# Altium schematic sheet Sheet1.SchDoc
size A3; DocumentNumber: 1; SheetNumber: 1; SheetTotal: 7
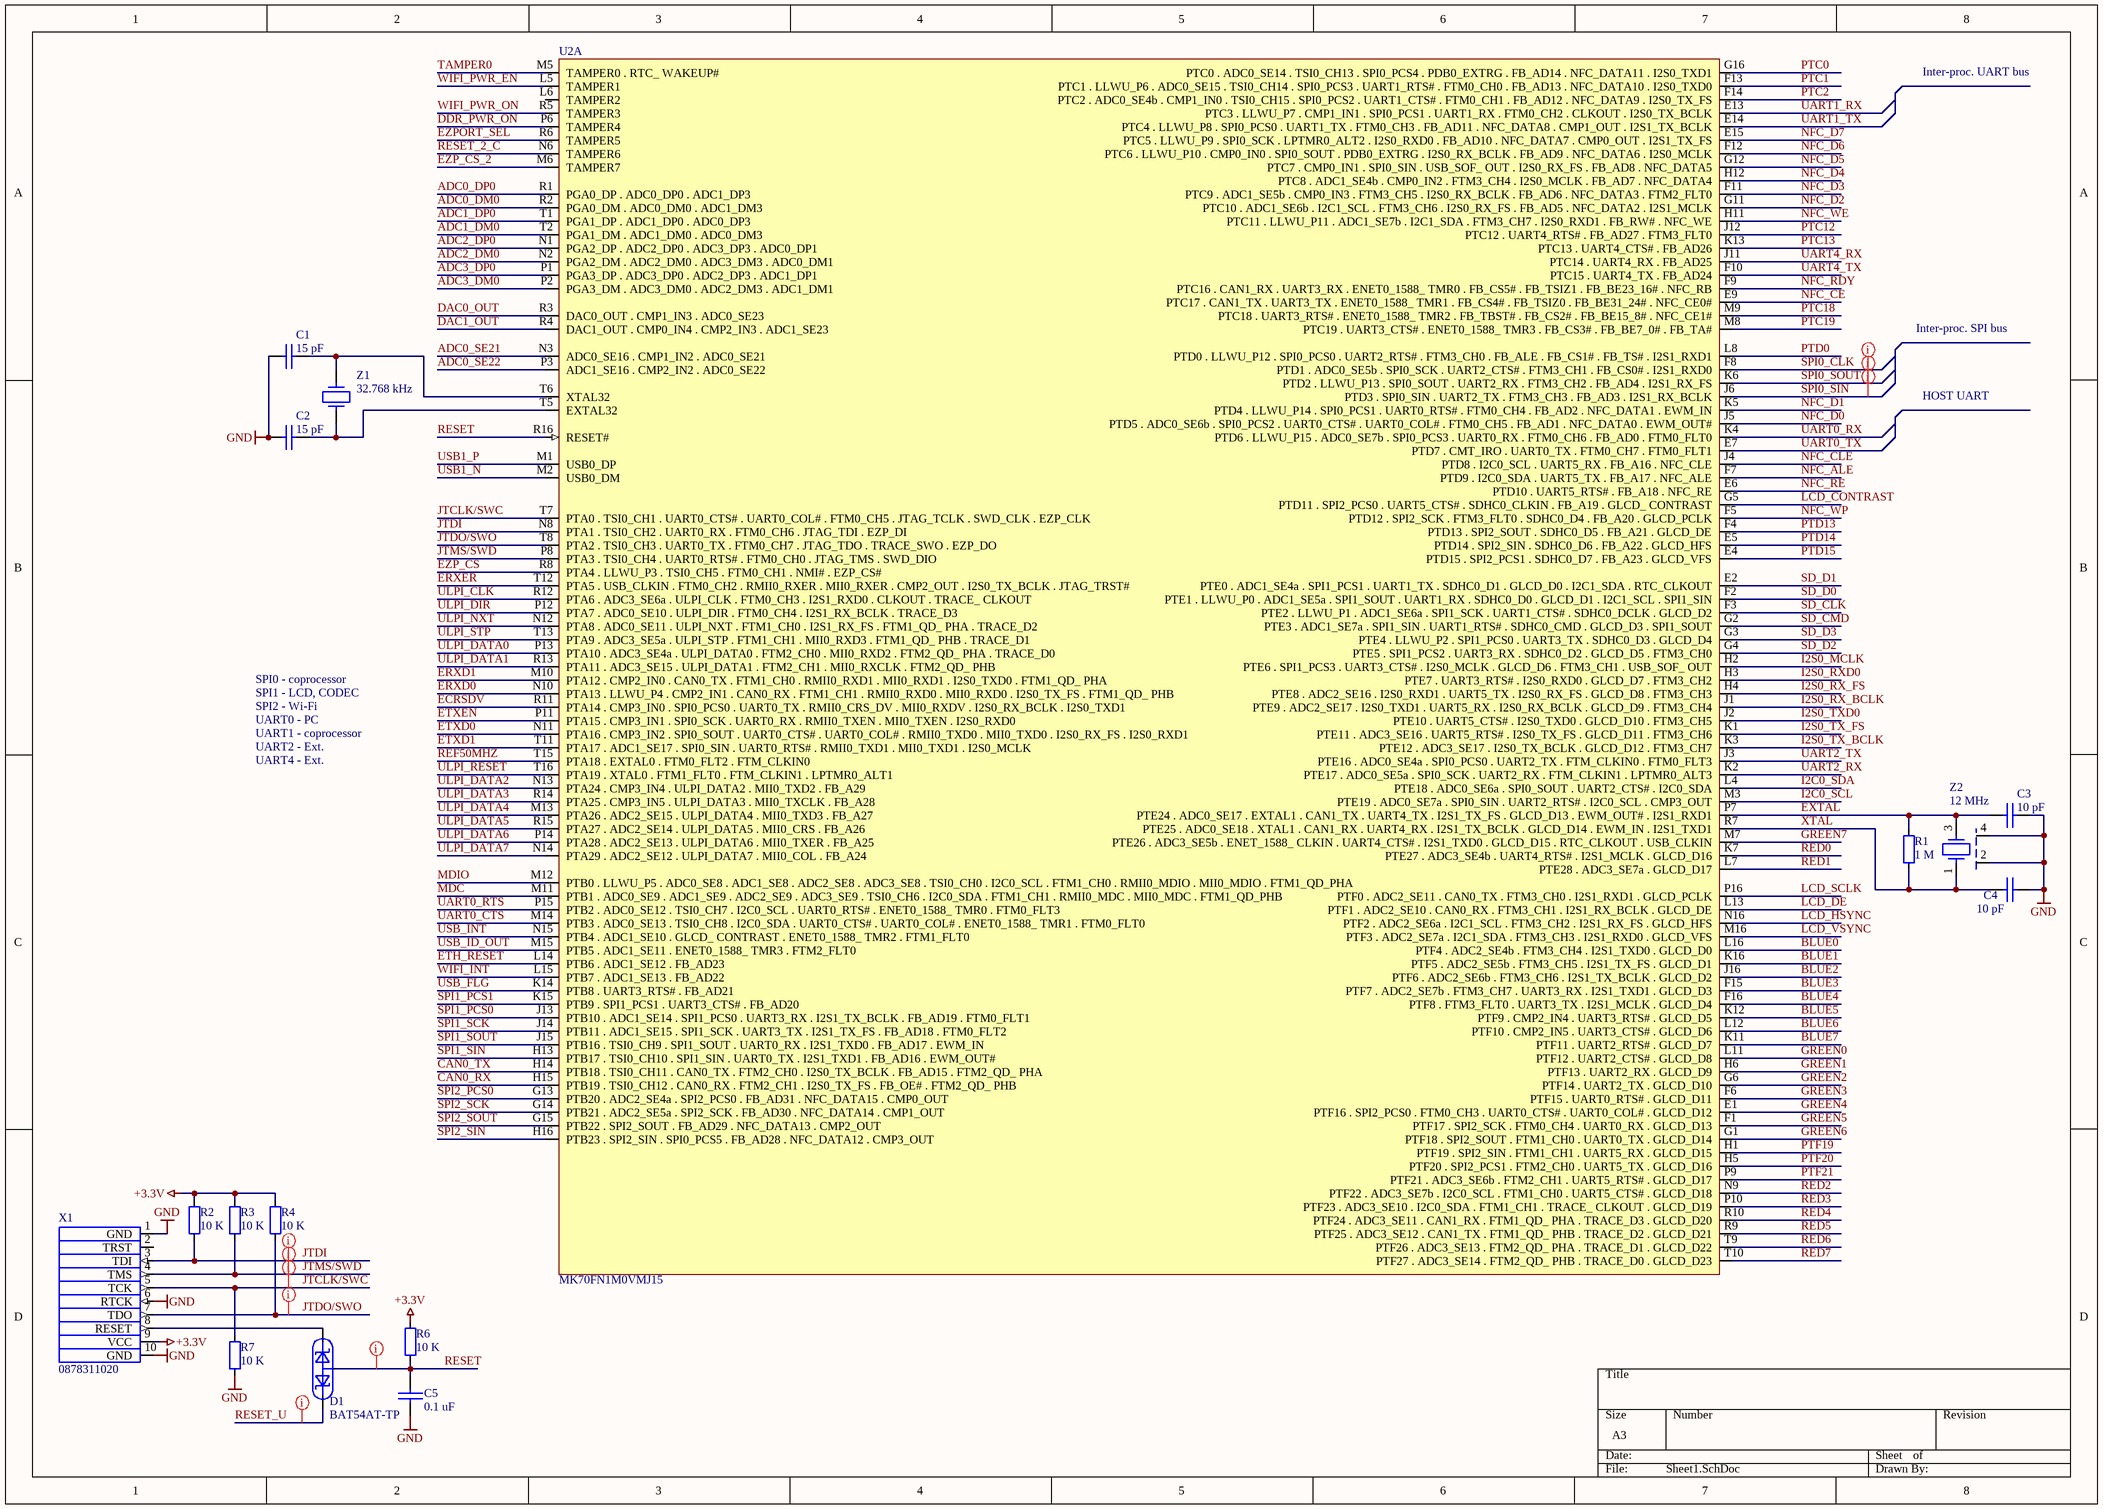
[diagram p0: Sheet1.SchDoc]

## Parts
C1  value 15 pF  [1608[0603]]  (hidden comment: CC0603JRNPO9BN150)
C2  value 15 pF  [1608[0603]]  (hidden comment: CC0603JRNPO9BN150)
C3  value 10 pF  [1608[0603]]  (hidden comment: CCPF010K0603)
C4  value 10 pF  [1608[0603]]  (hidden comment: CCPF010K0603)
C5  value 0.1 uF  [1005[0402]]  (hidden comment: CL10B104KA8NNND)
D1  BAT54AT-TP  [SOT-523F]
R1  value 1 M  [0603]  (hidden comment: RC0603FR-071ML)
R2  value 10 K  [0402]  (hidden comment: ERJ-3EKF1002V)
R3  value 10 K  [0402]  (hidden comment: ERJ-3EKF1002V)
R4  value 10 K  [0402]  (hidden comment: ERJ-3EKF1002V)
R6  value 10 K  [0402]  (hidden comment: ERJ-3EKF1002V)
R7  value 10 K  [0402]  (hidden comment: ERJ-3EKF1002V)
U2  MK70FN1M0VMJ15  [MAPBGA 256-pin]  (part A of 2)
X1  0878311020  [878311020 MGRID WALL HDR SMD]
Z1  value 32.768 kHz  [ABS10]  (hidden comment: CM200C32768DZBT)
Z2  value 12 MHz  [DSX321G]  (hidden comment: NX3225SA-12.000MHZ-STD-CSR-1)

## Nets
+3.3V: R2.1 R3.1 R4.1 R6.1 X1.9(VCC)
GND: C1.2 C2.2 C3.2 C4.2 C5.2 R7.2 X1.1(GND) X1.6(RTCK) X1.10(GND) Z2.2 Z2.4
ADC0_DM0: U2.R2(PGA0_DM_._ADC0_DM0_._ADC1_DM3)
ADC0_DP0: U2.R1(PGA0_DP_._ADC0_DP0_._ADC1_DP3)
ADC0_SE21: U2.N3(ADC0_SE16_._CMP1_IN2_._ADC0_SE21)
ADC0_SE22: U2.P3(ADC1_SE16_._CMP2_IN2_._ADC0_SE22)
ADC1_DM0: U2.T2(PGA1_DM_._ADC1_DM0_._ADC0_DM3)
ADC1_DP0: U2.T1(PGA1_DP_._ADC1_DP0_._ADC0_DP3)
ADC2_DM0: U2.N2(PGA2_DM_._ADC2_DM0_._ADC3_DM3_._ADC0_DM1)
ADC2_DP0: U2.N1(PGA2_DP_._ADC2_DP0_._ADC3_DP3_._ADC0_DP1)
ADC3_DM0: U2.P2(PGA3_DM_._ADC3_DM0_._ADC2_DM3_._ADC1_DM1)
ADC3_DP0: U2.P1(PGA3_DP_._ADC3_DP0_._ADC2_DP3_._ADC1_DP1)
BLUE0: U2.L16(PTF4_._ADC2_SE4b_._FTM3_CH4_._I2S1_TXD0_._GLCD_D0)
BLUE1: U2.K16(PTF5_._ADC2_SE5b_._FTM3_CH5_._I2S1_TX_FS_._GLCD_D1)
BLUE2: U2.J16(PTF6_._ADC2_SE6b_._FTM3_CH6_._I2S1_TX_BCLK_._GLCD_D2)
BLUE3: U2.F15(PTF7_._ADC2_SE7b_._FTM3_CH7_._UART3_RX_._I2S1_TXD1_._GLCD_D3)
BLUE4: U2.F16(PTF8_._FTM3_FLT0_._UART3_TX_._I2S1_MCLK_._GLCD_D4)
BLUE5: U2.K12(PTF9_._CMP2_IN4_._UART3_RTS#_._GLCD_D5)
BLUE6: U2.L12(PTF10_._CMP2_IN5_._UART3_CTS#_._GLCD_D6)
BLUE7: U2.K11(PTF11_._UART2_RTS#_._GLCD_D7)
CAN0_RX: U2.H15(PTB19_._TSI0_CH12_._CAN0_RX_._FTM2_CH1_._I2S0_TX_FS_._FB_OE#_._FTM2_QD__PHB)
CAN0_TX: U2.H14(PTB18_._TSI0_CH11_._CAN0_TX_._FTM2_CH0_._I2S0_TX_BCLK_._FB_AD15_._FTM2_QD__PHA)
DAC0_OUT: U2.R3(DAC0_OUT_._CMP1_IN3_._ADC0_SE23)
DAC1_OUT: U2.R4(DAC1_OUT_._CMP0_IN4_._CMP2_IN3_._ADC1_SE23)
DDR_PWR_ON: U2.P6(TAMPER4)
ECRSDV: U2.R11(PTA14_._CMP3_IN0_._SPI0_PCS0_._UART0_TX_._RMII0_CRS_DV_._MII0_RXDV_._I2S0_RX_BCLK_._I2S0_TXD1)
ERXD0: U2.N10(PTA13_._LLWU_P4_._CMP2_IN1_._CAN0_RX_._FTM1_CH1_._RMII0_RXD0_._MII0_RXD0_._I2S0_TX_FS_._FTM1_QD__PHB)
ERXD1: U2.M10(PTA12_._CMP2_IN0_._CAN0_TX_._FTM1_CH0_._RMII0_RXD1_._MII0_RXD1_._I2S0_TXD0_._FTM1_QD__PHA)
ERXER: U2.T12(PTA5_._USB_CLKIN_._FTM0_CH2_._RMII0_RXER_._MII0_RXER_._CMP2_OUT_._I2S0_TX_BCLK_._JTAG_TRST#)
ETH_RESET: U2.L14(PTB6_._ADC1_SE12_._FB_AD23)
ETXD0: U2.N11(PTA16_._CMP3_IN2_._SPI0_SOUT_._UART0_CTS#_._UART0_COL#_._RMII0_TXD0_._MII0_TXD0_._I2S0_RX_FS_._I2S0_RXD1)
ETXD1: U2.T11(PTA17_._ADC1_SE17_._SPI0_SIN_._UART0_RTS#_._RMII0_TXD1_._MII0_TXD1_._I2S0_MCLK)
ETXEN: U2.P11(PTA15_._CMP3_IN1_._SPI0_SCK_._UART0_RX_._RMII0_TXEN_._MII0_TXEN_._I2S0_RXD0)
EXTAL: C3.1 R1.2 U2.P7(PTE24_._ADC0_SE17_._EXTAL1_._CAN1_TX_._UART4_TX_._I2S1_TX_FS_._GLCD_D13_._EWM_OUT#_._I2S1_RXD1) Z2.3
EZP_CS: U2.R8(PTA4_._LLWU_P3_._TSI0_CH5_._FTM0_CH1_._NMI#_._EZP_CS#)
EZP_CS_2: U2.M6(TAMPER7)
EZPORT_SEL: U2.R6(TAMPER5)
GREEN0: U2.L11(PTF12_._UART2_CTS#_._GLCD_D8)
GREEN1: U2.H6(PTF13_._UART2_RX_._GLCD_D9)
GREEN2: U2.G6(PTF14_._UART2_TX_._GLCD_D10)
GREEN3: U2.F6(PTF15_._UART0_RTS#_._GLCD_D11)
GREEN4: U2.E1(PTF16_._SPI2_PCS0_._FTM0_CH3_._UART0_CTS#_._UART0_COL#_._GLCD_D12)
GREEN5: U2.F1(PTF17_._SPI2_SCK_._FTM0_CH4_._UART0_RX_._GLCD_D13)
GREEN6: U2.G1(PTF18_._SPI2_SOUT_._FTM1_CH0_._UART0_TX_._GLCD_D14)
GREEN7: U2.M7(PTE26_._ADC3_SE5b_._ENET_1588__CLKIN_._UART4_CTS#_._I2S1_TXD0_._GLCD_D15_._RTC_CLKOUT_._USB_CLKIN)
I2C0_SCL: U2.M3(PTE19_._ADC0_SE7a_._SPI0_SIN_._UART2_RTS#_._I2C0_SCL_._CMP3_OUT)
I2C0_SDA: U2.L4(PTE18_._ADC0_SE6a_._SPI0_SOUT_._UART2_CTS#_._I2C0_SDA)
I2S0_MCLK: U2.H2(PTE6_._SPI1_PCS3_._UART3_CTS#_._I2S0_MCLK_._GLCD_D6_._FTM3_CH1_._USB_SOF__OUT)
I2S0_RX_BCLK: U2.J1(PTE9_._ADC2_SE17_._I2S0_TXD1_._UART5_RX_._I2S0_RX_BCLK_._GLCD_D9_._FTM3_CH4)
I2S0_RX_FS: U2.H4(PTE8_._ADC2_SE16_._I2S0_RXD1_._UART5_TX_._I2S0_RX_FS_._GLCD_D8_._FTM3_CH3)
I2S0_RXD0: U2.H3(PTE7_._UART3_RTS#_._I2S0_RXD0_._GLCD_D7_._FTM3_CH2)
I2S0_TX_BCLK: U2.K3(PTE12_._ADC3_SE17_._I2S0_TX_BCLK_._GLCD_D12_._FTM3_CH7)
I2S0_TX_FS: U2.K1(PTE11_._ADC3_SE16_._UART5_RTS#_._I2S0_TX_FS_._GLCD_D11_._FTM3_CH6)
I2S0_TXD0: U2.J2(PTE10_._UART5_CTS#_._I2S0_TXD0_._GLCD_D10_._FTM3_CH5)
JTCLK/SWC: R7.1 U2.T7(PTA0_._TSI0_CH1_._UART0_CTS#_._UART0_COL#_._FTM0_CH5_._JTAG_TCLK_._SWD_CLK_._EZP_CLK) X1.5(TCK)
JTDI: R2.2 U2.N8(PTA1_._TSI0_CH2_._UART0_RX_._FTM0_CH6_._JTAG_TDI_._EZP_DI) X1.3(TDI)
JTDO/SWO: R4.2 U2.T8(PTA2_._TSI0_CH3_._UART0_TX_._FTM0_CH7_._JTAG_TDO_._TRACE_SWO_._EZP_DO) X1.7(TDO)
JTMS/SWD: R3.2 U2.P8(PTA3_._TSI0_CH4_._UART0_RTS#_._FTM0_CH0_._JTAG_TMS_._SWD_DIO) X1.4(TMS)
LCD_CONTRAST: U2.G5(PTD11_._SPI2_PCS0_._UART5_CTS#_._SDHC0_CLKIN_._FB_A19_._GLCD__CONTRAST)
LCD_DE: U2.L13(PTF1_._ADC2_SE10_._CAN0_RX_._FTM3_CH1_._I2S1_RX_BCLK_._GLCD_DE)
LCD_HSYNC: U2.N16(PTF2_._ADC2_SE6a_._I2C1_SCL_._FTM3_CH2_._I2S1_RX_FS_._GLCD_HFS)
LCD_SCLK: U2.P16(PTF0_._ADC2_SE11_._CAN0_TX_._FTM3_CH0_._I2S1_RXD1_._GLCD_PCLK)
LCD_VSYNC: U2.M16(PTF3_._ADC2_SE7a_._I2C1_SDA_._FTM3_CH3_._I2S1_RXD0_._GLCD_VFS)
MDC: U2.M11(PTB1_._ADC0_SE9_._ADC1_SE9_._ADC2_SE9_._ADC3_SE9_._TSI0_CH6_._I2C0_SDA_._FTM1_CH1_._RMII0_MDC_._MII0_MDC_._FTM1_QD_PHB)
MDIO: U2.M12(PTB0_._LLWU_P5_._ADC0_SE8_._ADC1_SE8_._ADC2_SE8_._ADC3_SE8_._TSI0_CH0_._I2C0_SCL_._FTM1_CH0_._RMII0_MDIO_._MII0_MDIO_._FTM1_QD_PHA)
NFC_ALE: U2.F7(PTD9_._I2C0_SDA_._UART5_TX_._FB_A17_._NFC_ALE)
NFC_CE: U2.E9(PTC17_._CAN1_TX_._UART3_TX_._ENET0_1588__TMR1_._FB_CS4#_._FB_TSIZ0_._FB_BE31_24#_._NFC_CE0#)
NFC_CLE: U2.J4(PTD8_._I2C0_SCL_._UART5_RX_._FB_A16_._NFC_CLE)
NFC_D0: U2.J5(PTD5_._ADC0_SE6b_._SPI0_PCS2_._UART0_CTS#_._UART0_COL#_._FTM0_CH5_._FB_AD1_._NFC_DATA0_._EWM_OUT#)
NFC_D1: U2.K5(PTD4_._LLWU_P14_._SPI0_PCS1_._UART0_RTS#_._FTM0_CH4_._FB_AD2_._NFC_DATA1_._EWM_IN)
NFC_D2: U2.G11(PTC10_._ADC1_SE6b_._I2C1_SCL_._FTM3_CH6_._I2S0_RX_FS_._FB_AD5_._NFC_DATA2_._I2S1_MCLK)
NFC_D3: U2.F11(PTC9_._ADC1_SE5b_._CMP0_IN3_._FTM3_CH5_._I2S0_RX_BCLK_._FB_AD6_._NFC_DATA3_._FTM2_FLT0)
NFC_D4: U2.H12(PTC8_._ADC1_SE4b_._CMP0_IN2_._FTM3_CH4_._I2S0_MCLK_._FB_AD7_._NFC_DATA4)
NFC_D5: U2.G12(PTC7_._CMP0_IN1_._SPI0_SIN_._USB_SOF__OUT_._I2S0_RX_FS_._FB_AD8_._NFC_DATA5)
NFC_D6: U2.F12(PTC6_._LLWU_P10_._CMP0_IN0_._SPI0_SOUT_._PDB0_EXTRG_._I2S0_RX_BCLK_._FB_AD9_._NFC_DATA6_._I2S0_MCLK)
NFC_D7: U2.E15(PTC5_._LLWU_P9_._SPI0_SCK_._LPTMR0_ALT2_._I2S0_RXD0_._FB_AD10_._NFC_DATA7_._CMP0_OUT_._I2S1_TX_FS)
NFC_RDY: U2.F9(PTC16_._CAN1_RX_._UART3_RX_._ENET0_1588__TMR0_._FB_CS5#_._FB_TSIZ1_._FB_BE23_16#_._NFC_RB)
NFC_RE: U2.E6(PTD10_._UART5_RTS#_._FB_A18_._NFC_RE)
NFC_WE: U2.H11(PTC11_._LLWU_P11_._ADC1_SE7b_._I2C1_SDA_._FTM3_CH7_._I2S0_RXD1_._FB_RW#_._NFC_WE)
NFC_WP: U2.F5(PTD12_._SPI2_SCK_._FTM3_FLT0_._SDHC0_D4_._FB_A20_._GLCD_PCLK)
PTC0: U2.G16(PTC0_._ADC0_SE14_._TSI0_CH13_._SPI0_PCS4_._PDB0_EXTRG_._FB_AD14_._NFC_DATA11_._I2S0_TXD1)
PTC1: U2.F13(PTC1_._LLWU_P6_._ADC0_SE15_._TSI0_CH14_._SPI0_PCS3_._UART1_RTS#_._FTM0_CH0_._FB_AD13_._NFC_DATA10_._I2S0_TXD0)
PTC2: U2.F14(PTC2_._ADC0_SE4b_._CMP1_IN0_._TSI0_CH15_._SPI0_PCS2_._UART1_CTS#_._FTM0_CH1_._FB_AD12_._NFC_DATA9_._I2S0_TX_FS)
PTC12: U2.J12(PTC12_._UART4_RTS#_._FB_AD27_._FTM3_FLT0)
PTC13: U2.K13(PTC13_._UART4_CTS#_._FB_AD26)
PTC18: U2.M9(PTC18_._UART3_RTS#_._ENET0_1588__TMR2_._FB_TBST#_._FB_CS2#_._FB_BE15_8#_._NFC_CE1#)
PTC19: U2.M8(PTC19_._UART3_CTS#_._ENET0_1588__TMR3_._FB_CS3#_._FB_BE7_0#_._FB_TA#)
PTD0: U2.L8(PTD0_._LLWU_P12_._SPI0_PCS0_._UART2_RTS#_._FTM3_CH0_._FB_ALE_._FB_CS1#_._FB_TS#_._I2S1_RXD1)
PTD13: U2.F4(PTD13_._SPI2_SOUT_._SDHC0_D5_._FB_A21_._GLCD_DE)
PTD14: U2.E5(PTD14_._SPI2_SIN_._SDHC0_D6_._FB_A22_._GLCD_HFS)
PTD15: U2.E4(PTD15_._SPI2_PCS1_._SDHC0_D7_._FB_A23_._GLCD_VFS)
PTF19: U2.H1(PTF19_._SPI2_SIN_._FTM1_CH1_._UART5_RX_._GLCD_D15)
PTF20: U2.H5(PTF20_._SPI2_PCS1_._FTM2_CH0_._UART5_TX_._GLCD_D16)
PTF21: U2.P9(PTF21_._ADC3_SE6b_._FTM2_CH1_._UART5_RTS#_._GLCD_D17)
RED0: U2.K7(PTE27_._ADC3_SE4b_._UART4_RTS#_._I2S1_MCLK_._GLCD_D16)
RED1: U2.L7(PTE28_._ADC3_SE7a_._GLCD_D17)
RED2: U2.N9(PTF22_._ADC3_SE7b_._I2C0_SCL_._FTM1_CH0_._UART5_CTS#_._GLCD_D18)
RED3: U2.P10(PTF23_._ADC3_SE10_._I2C0_SDA_._FTM1_CH1_._TRACE__CLKOUT_._GLCD_D19)
RED4: U2.R10(PTF24_._ADC3_SE11_._CAN1_RX_._FTM1_QD__PHA_._TRACE_D3_._GLCD_D20)
RED5: U2.R9(PTF25_._ADC3_SE12_._CAN1_TX_._FTM1_QD__PHB_._TRACE_D2_._GLCD_D21)
RED6: U2.T9(PTF26_._ADC3_SE13_._FTM2_QD__PHA_._TRACE_D1_._GLCD_D22)
RED7: U2.T10(PTF27_._ADC3_SE14_._FTM2_QD__PHB_._TRACE_D0_._GLCD_D23)
REF50MHZ: U2.T15(PTA18_._EXTAL0_._FTM0_FLT2_._FTM_CLKIN0)
RESET: C5.1 D1.3 R6.2 U2.R16(RESET#)
RESET_2_C: U2.N6(TAMPER6)
RESET_U: D1.2
SD_CLK: U2.F3(PTE2_._LLWU_P1_._ADC1_SE6a_._SPI1_SCK_._UART1_CTS#_._SDHC0_DCLK_._GLCD_D2)
SD_CMD: U2.G2(PTE3_._ADC1_SE7a_._SPI1_SIN_._UART1_RTS#_._SDHC0_CMD_._GLCD_D3_._SPI1_SOUT)
SD_D0: U2.F2(PTE1_._LLWU_P0_._ADC1_SE5a_._SPI1_SOUT_._UART1_RX_._SDHC0_D0_._GLCD_D1_._I2C1_SCL_._SPI1_SIN)
SD_D1: U2.E2(PTE0_._ADC1_SE4a_._SPI1_PCS1_._UART1_TX_._SDHC0_D1_._GLCD_D0_._I2C1_SDA_._RTC_CLKOUT)
SD_D2: U2.G4(PTE5_._SPI1_PCS2_._UART3_RX_._SDHC0_D2_._GLCD_D5_._FTM3_CH0)
SD_D3: U2.G3(PTE4_._LLWU_P2_._SPI1_PCS0_._UART3_TX_._SDHC0_D3_._GLCD_D4)
SPI0_CLK: U2.F8(PTD1_._ADC0_SE5b_._SPI0_SCK_._UART2_CTS#_._FTM3_CH1_._FB_CS0#_._I2S1_RXD0)
SPI0_SIN: U2.J6(PTD3_._SPI0_SIN_._UART2_TX_._FTM3_CH3_._FB_AD3_._I2S1_RX_BCLK)
SPI0_SOUT: U2.K6(PTD2_._LLWU_P13_._SPI0_SOUT_._UART2_RX_._FTM3_CH2_._FB_AD4_._I2S1_RX_FS)
SPI1_PCS0: U2.J13(PTB10_._ADC1_SE14_._SPI1_PCS0_._UART3_RX_._I2S1_TX_BCLK_._FB_AD19_._FTM0_FLT1)
SPI1_PCS1: U2.K15(PTB9_._SPI1_PCS1_._UART3_CTS#_._FB_AD20)
SPI1_SCK: U2.J14(PTB11_._ADC1_SE15_._SPI1_SCK_._UART3_TX_._I2S1_TX_FS_._FB_AD18_._FTM0_FLT2)
SPI1_SIN: U2.H13(PTB17_._TSI0_CH10_._SPI1_SIN_._UART0_TX_._I2S1_TXD1_._FB_AD16_._EWM_OUT#)
SPI1_SOUT: U2.J15(PTB16_._TSI0_CH9_._SPI1_SOUT_._UART0_RX_._I2S1_TXD0_._FB_AD17_._EWM_IN)
SPI2_PCS0: U2.G13(PTB20_._ADC2_SE4a_._SPI2_PCS0_._FB_AD31_._NFC_DATA15_._CMP0_OUT)
SPI2_SCK: U2.G14(PTB21_._ADC2_SE5a_._SPI2_SCK_._FB_AD30_._NFC_DATA14_._CMP1_OUT)
SPI2_SIN: U2.H16(PTB23_._SPI2_SIN_._SPI0_PCS5_._FB_AD28_._NFC_DATA12_._CMP3_OUT)
SPI2_SOUT: U2.G15(PTB22_._SPI2_SOUT_._FB_AD29_._NFC_DATA13_._CMP2_OUT)
TAMPER0: U2.M5(TAMPER0_._RTC__WAKEUP#)
UART0_CTS: U2.M14(PTB3_._ADC0_SE13_._TSI0_CH8_._I2C0_SDA_._UART0_CTS#_._UART0_COL#_._ENET0_1588__TMR1_._FTM0_FLT0)
UART0_RTS: U2.P15(PTB2_._ADC0_SE12_._TSI0_CH7_._I2C0_SCL_._UART0_RTS#_._ENET0_1588__TMR0_._FTM0_FLT3)
UART0_RX: U2.K4(PTD6_._LLWU_P15_._ADC0_SE7b_._SPI0_PCS3_._UART0_RX_._FTM0_CH6_._FB_AD0_._FTM0_FLT0)
UART0_TX: U2.E7(PTD7_._CMT_IRO_._UART0_TX_._FTM0_CH7_._FTM0_FLT1)
UART1_RX: U2.E13(PTC3_._LLWU_P7_._CMP1_IN1_._SPI0_PCS1_._UART1_RX_._FTM0_CH2_._CLKOUT_._I2S0_TX_BCLK)
UART1_TX: U2.E14(PTC4_._LLWU_P8_._SPI0_PCS0_._UART1_TX_._FTM0_CH3_._FB_AD11_._NFC_DATA8_._CMP1_OUT_._I2S1_TX_BCLK)
UART2_RX: U2.K2(PTE17_._ADC0_SE5a_._SPI0_SCK_._UART2_RX_._FTM_CLKIN1_._LPTMR0_ALT3)
UART2_TX: U2.J3(PTE16_._ADC0_SE4a_._SPI0_PCS0_._UART2_TX_._FTM_CLKIN0_._FTM0_FLT3)
UART4_RX: U2.J11(PTC14_._UART4_RX_._FB_AD25)
UART4_TX: U2.F10(PTC15_._UART4_TX_._FB_AD24)
ULPI_CLK: U2.R12(PTA6_._ADC3_SE6a_._ULPI_CLK_._FTM0_CH3_._I2S1_RXD0_._CLKOUT_._TRACE__CLKOUT)
ULPI_DATA0: U2.P13(PTA10_._ADC3_SE4a_._ULPI_DATA0_._FTM2_CH0_._MII0_RXD2_._FTM2_QD__PHA_._TRACE_D0)
ULPI_DATA1: U2.R13(PTA11_._ADC3_SE15_._ULPI_DATA1_._FTM2_CH1_._MII0_RXCLK_._FTM2_QD__PHB)
ULPI_DATA2: U2.N13(PTA24_._CMP3_IN4_._ULPI_DATA2_._MII0_TXD2_._FB_A29)
ULPI_DATA3: U2.R14(PTA25_._CMP3_IN5_._ULPI_DATA3_._MII0_TXCLK_._FB_A28)
ULPI_DATA4: U2.M13(PTA26_._ADC2_SE15_._ULPI_DATA4_._MII0_TXD3_._FB_A27)
ULPI_DATA5: U2.R15(PTA27_._ADC2_SE14_._ULPI_DATA5_._MII0_CRS_._FB_A26)
ULPI_DATA6: U2.P14(PTA28_._ADC2_SE13_._ULPI_DATA6_._MII0_TXER_._FB_A25)
ULPI_DATA7: U2.N14(PTA29_._ADC2_SE12_._ULPI_DATA7_._MII0_COL_._FB_A24)
ULPI_DIR: U2.P12(PTA7_._ADC0_SE10_._ULPI_DIR_._FTM0_CH4_._I2S1_RX_BCLK_._TRACE_D3)
ULPI_NXT: U2.N12(PTA8_._ADC0_SE11_._ULPI_NXT_._FTM1_CH0_._I2S1_RX_FS_._FTM1_QD__PHA_._TRACE_D2)
ULPI_RESET: U2.T16(PTA19_._XTAL0_._FTM1_FLT0_._FTM_CLKIN1_._LPTMR0_ALT1)
ULPI_STP: U2.T13(PTA9_._ADC3_SE5a_._ULPI_STP_._FTM1_CH1_._MII0_RXD3_._FTM1_QD__PHB_._TRACE_D1)
USB1_N: U2.M2(USB0_DM)
USB1_P: U2.M1(USB0_DP)
USB_FLG: U2.K14(PTB8_._UART3_RTS#_._FB_AD21)
USB_ID_OUT: U2.M15(PTB5_._ADC1_SE11_._ENET0_1588__TMR3_._FTM2_FLT0)
USB_INT: U2.N15(PTB4_._ADC1_SE10_._GLCD__CONTRAST_._ENET0_1588__TMR2_._FTM1_FLT0)
WIFI_INT: U2.L15(PTB7_._ADC1_SE13_._FB_AD22)
WIFI_PWR_EN: U2.L5(TAMPER1)
WIFI_PWR_ON: U2.R5(TAMPER3)
XTAL: C4.1 R1.1 U2.R7(PTE25_._ADC0_SE18_._XTAL1_._CAN1_RX_._UART4_RX_._I2S1_TX_BCLK_._GLCD_D14_._EWM_IN_._I2S1_TXD1) Z2.1
NetC1_1: C1.1 U2.T6(XTAL32) Z1.1
NetC2_1: C2.1 U2.T5(EXTAL32) Z1.2
NetD1_1: D1.1 X1.8(RESET)

Not connected (* = marked no-connect by the designer): U2 L6(TAMPER2); X1 2(TRST)

## Layout directives
net class JTAG1: JTCLK/SWC, JTDI, JTDO/SWO, JTMS/SWD, RESET, RESET_U
net class IPC_SPI: SPI0_CLK, SPI0_SIN, SPI0_SOUT

## Notes on the sheet
- Inter-proc. UART bus
- Inter-proc. SPI bus
- HOST UART
- SPI0 - coprocessor
- SPI1 - LCD, CODEC
- SPI2 - Wi-Fi
- UART0 - PC
- UART1 - coprocessor
- UART2 - Ext.
- UART4 - Ext.

## Library data of the parts
C1 C2 = CCPF015K0603: 15 pF, 50V, 5%, NP0, 0603 SMD MLC Capacitor; Manufacturer: YAGEO AMERICA CORPORATION; Tolerance: 5%; Price: 0.003$; Distributor: Future; PartNum: CC0603JRNPO9BN150; Voltage: 50 V; PartName: CC0603JRNPO9BN150; Price50: 0.003$; Price100: 0.003$; Price1000: 0.003$
C3 C4 = CCPF010K0603: 10 pF, 50V, 5%, NP0, 0603 SMD MLC Capacitor; Manufacturer: Kemet; PartNum: 399-1049-1-ND; PartName: C0603C100J5GACTU; Tolerance: 5%; Price: 0.0075$; Distributor: Digi-Key; Voltage: 50 V
C5 = GRM155R71C104KA88D: 0.1 uF, 16V, 10%, X7R, 0402; Manufacturer: Murata; PartNum: 490-3261-1-ND; Tolerance: 10%; Distributor: Digi-Key; Price: 0.005$; Voltage: 16 V
D1 = BAT54AT-TP: Schottky Diode, 30 V, 200 mA, common anode, SOT523; Manufacturer: Micro Commercial Co; PartNum: BAT54AT-TPDKR-ND; Distributor: Digi-Key; Price: 0.52$; PartName: BAT54AT-TP
R1 = RC0603FR-071ML: 1 M, 1%, 0603, SMD Resistor, Taped; Manufacturer: YAGEO AMERICA CORPORATION; Voltage: 75 V; Distributor: Future; Price: 0.002 Euro; Tolerance: 1%; PartNum: RC0603FR-071ML; PartName: RC0603FR-071ML
R2-R4 R6 R7 = RC0402JR-0710KL: 10 K, 5%, 0402, SMD Resistor, Taped; Manufacturer: Yageo; PartNum: 311-10KJRCT-ND; Voltage: 75 V; Distributor: Digi-Key; Price: 0.1$; Tolerance: 5%; PartName: RC0402JR-0710KL
U2 = MK70FN1M0VMJ15: 32-Bit 150 Mhz ARM 1MB FLASH 256MAPBGA; Manufacturer: Freescale; PartNum: MK70FN1M0VMJ15-ND; PartName: MK70FN1M0VMJ15; Price: 16.5$; Distributor: Digi-Key
X1 = 0878321020: JTAG, CONN HEADER 10POS 2MM VERT SMD; Manufacturer: Molex Inc; PartNum: WM18639-ND; Distributor: Digi-Key; Price: 1.29$; PartName: 0878321020
Z1 = ABS10-32.768KHZ-T: 32.768 kHz, 12.5 pF, 70 kOhm, ±20ppm, -40°C ~ 80°C; Manufacturer: Abracon Corporation; PartNum: 535-9536-1-ND; Price: 0.82$; Tolerance: 20 ppm; Distributor: Digi-Key; PartName: ABS10-32.768KHZ-T
Z2 = NX3225SA-12.000MHZ-STD-CSR-1: 12 MHz, 8 pF, ±15ppm, -10...+75 С; Manufacturer: NDK; PartNum: 644-1047-1-ND; Price: 1$; Distributor: Digi-Key; Tolerance: 15 ppm; PartName: NX3225SA-12.000MHZ-STD-CSR-1